# EAGLE schematic coilcube (EAGLE 6.4)
REV: 2v0; TITLE: Coilcube

## Sheet 1 of 2: EPIC & Programmer
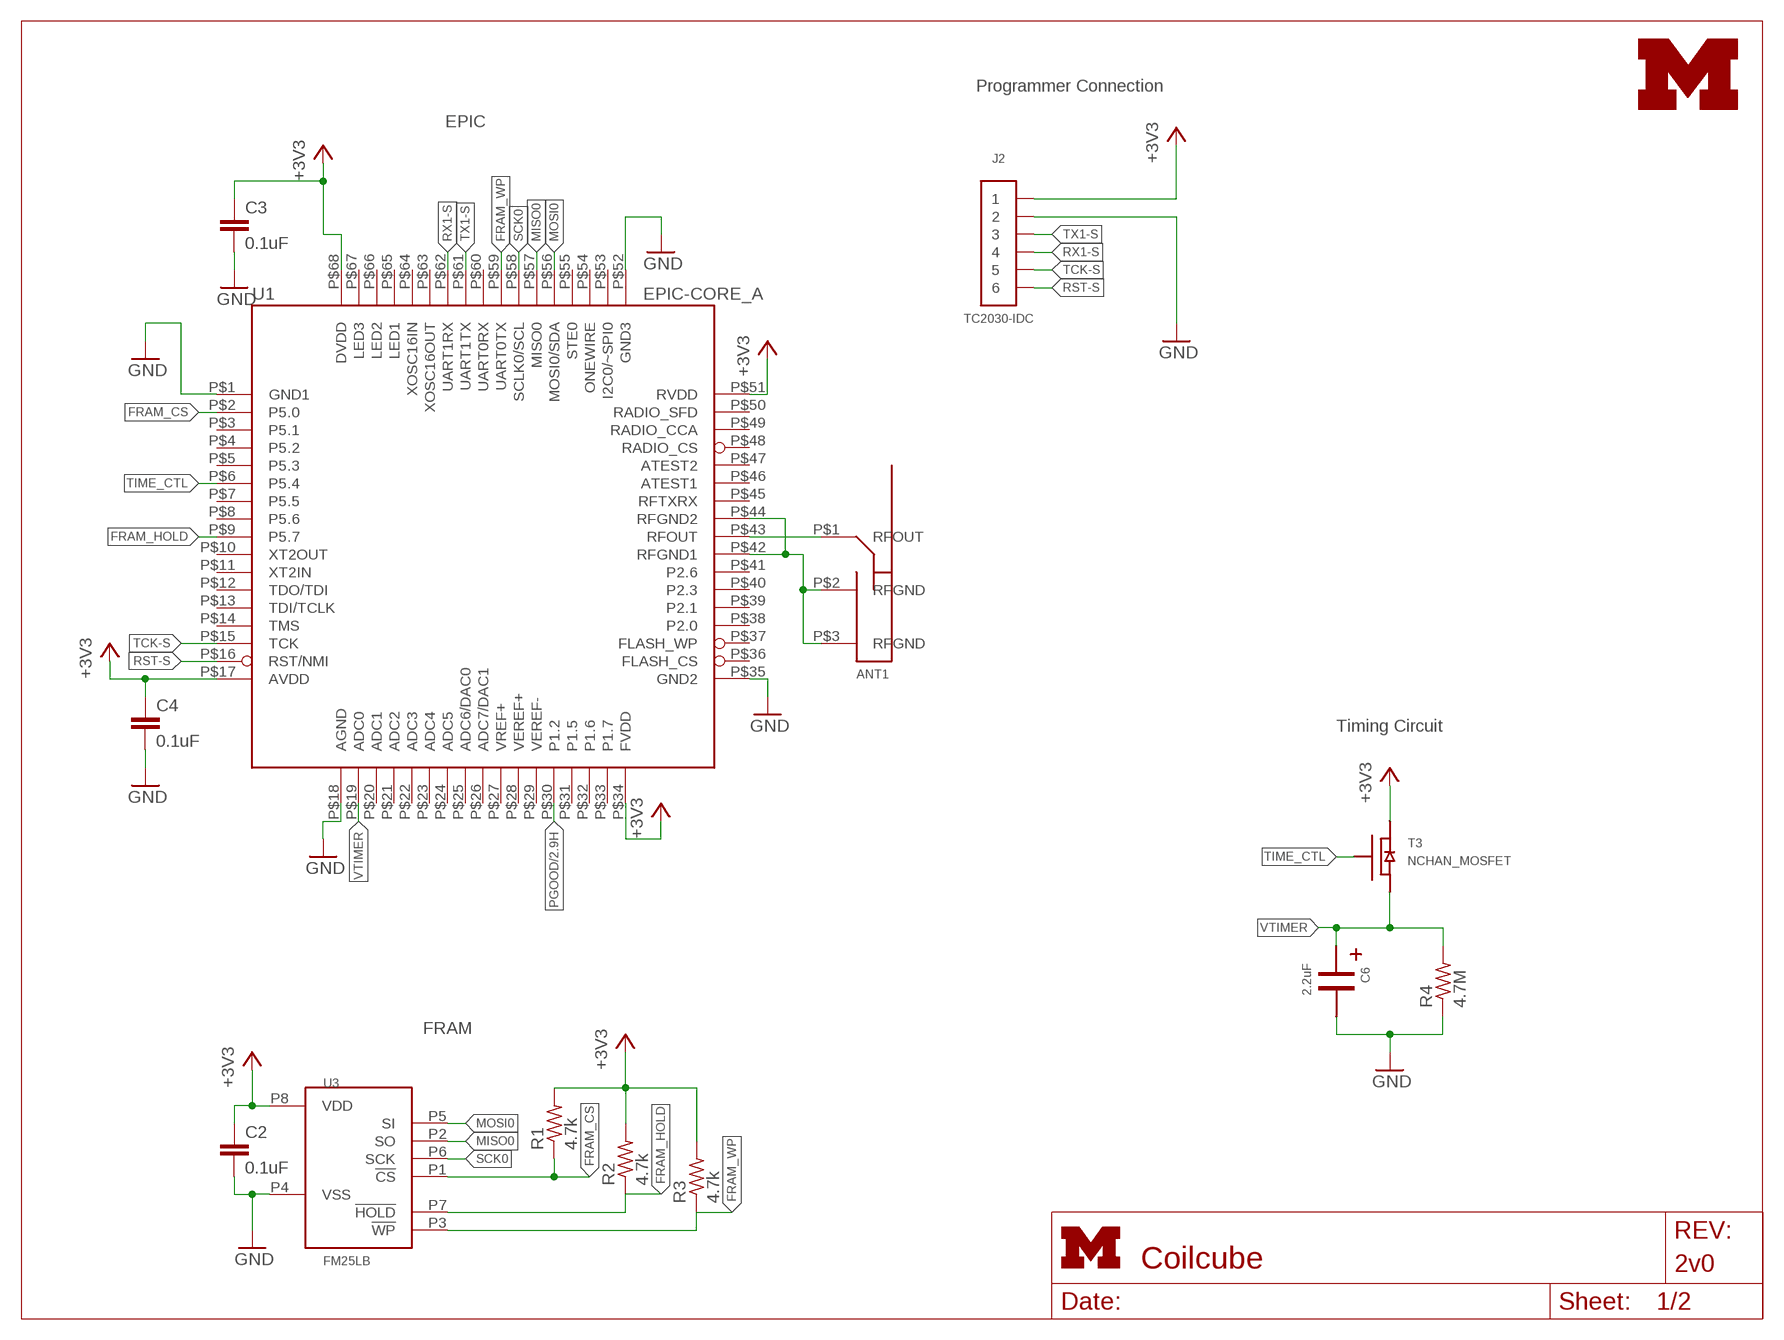
[diagram p0: schematic, sheet 1]
FRAME1 (LETTER_L): HEIGHT: 8.5in; WIDTH: 11in

### Parts
ANT1  PIFA-2.4GHZ  [PIFA-2.4GHZ]
C2  0.1uF  C-EUC0603  [C0603]
C3  0.1uF  C-EUC0603  [C0603]
C4  0.1uF  C-EUC0603  [C0603]
C6  2.2uF  CAP_POLEA1MM5  [CPOL_EEA_1MM5]
J2  TC2030-IDC  [TC2030-IDC]
R1  4.7k  R-US_R0603  [R0603]
R2  4.7k  R-US_R0603  [R0603]
R3  4.7k  R-US_R0603  [R0603]
R4  4.7M  R-US_R0805  [R0805]
T3  NCHAN_MOSFET  [NCHAN_MOSFET]
U1  EPIC-CORE_A  [EPIC-LCC68]
U3  FM25LB  [SOIC_8]
U$1  UMICH_SOLID_MEDIUM  [UMICH_SOLID_200MIL]

### Nets
+3V3: C2.1 C3.1 C4.1 J2.1 R1.2 R2.2 R3.2 T3.D U1.P$17(AVDD) U1.P$34(FVDD) U1.P$51(RVDD) U1.P$68(DVDD) U3.P8(VDD) ; also sheet 2
FRAM_CS: R1.1 U1.P$2(P5.0) U3.P1(!CS)
FRAM_HOLD: R2.1 U1.P$9(P5.7) U3.P7(!HOLD)
FRAM_WP: R3.1 U1.P$59(UART0TX) U3.P3(!WP)
GND: C2.2 C3.2 C4.2 C6.- J2.2 R4.1 U1.P$1(GND1) U1.P$18(AGND) U1.P$35(GND2) U1.P$52(GND3) U3.P4(VSS) ; also sheet 2
MISO0: U1.P$57(MISO0) U3.P2(SO)
MOSI0: U1.P$56(MOSI0/SDA) U3.P5(SI)
N$1: ANT1.P$1(RFOUT) U1.P$43(RFOUT)
PGOOD: U1.P$30(P1.2) ; also sheet 2
RFGND: ANT1.P$2(RFGND) ANT1.P$3(RFGND) U1.P$42(RFGND1) U1.P$44(RFGND2)
RST-S: J2.6 U1.P$16(RST/NMI)
RX1-S: J2.4 U1.P$62(UART1RX)
SCK0: U1.P$58(SCLK0/SCL) U3.P6(SCK)
TCK-S: J2.5 U1.P$15(TCK)
TIME_CTL: T3.G U1.P$6(P5.4)
TX1-S: J2.3 U1.P$61(UART1TX)
VTIMER: C6.+ R4.2 T3.S U1.P$19(ADC0)
Unconnected: U1.P$3(P5.1) U1.P$4(P5.2) U1.P$5(P5.3) U1.P$7(P5.5) U1.P$8(P5.6) U1.P$10(XT2OUT) U1.P$11(XT2IN) U1.P$12(TDO/TDI) U1.P$13(TDI/TCLK) U1.P$14(TMS) U1.P$20(ADC1) U1.P$21(ADC2) U1.P$22(ADC3) U1.P$23(ADC4) U1.P$24(ADC5) U1.P$25(ADC6/DAC0) U1.P$26(ADC7/DAC1) U1.P$27(VREF+) U1.P$28(VEREF+) U1.P$29(VEREF-) U1.P$31(P1.5) U1.P$32(P1.6) U1.P$33(P1.7) U1.P$36(FLASH_CS) U1.P$37(FLASH_WP) U1.P$38(P2.0) U1.P$39(P2.1) U1.P$40(P2.3) U1.P$41(P2.6) U1.P$45(RFTXRX) U1.P$46(ATEST1) U1.P$47(ATEST2) U1.P$48(RADIO_CS) U1.P$49(RADIO_CCA) U1.P$50(RADIO_SFD) U1.P$53(I2C0/~SPI0) U1.P$54(ONEWIRE) U1.P$55(STE0) U1.P$60(UART0RX) U1.P$63(XOSC16OUT) U1.P$64(XOSC16IN) U1.P$65(LED1) U1.P$66(LED2) U1.P$67(LED3)

### Notes on the sheet
- Programmer Connection
- EPIC
- Timing Circuit
- FRAM

## Sheet 2 of 2: Power Supply
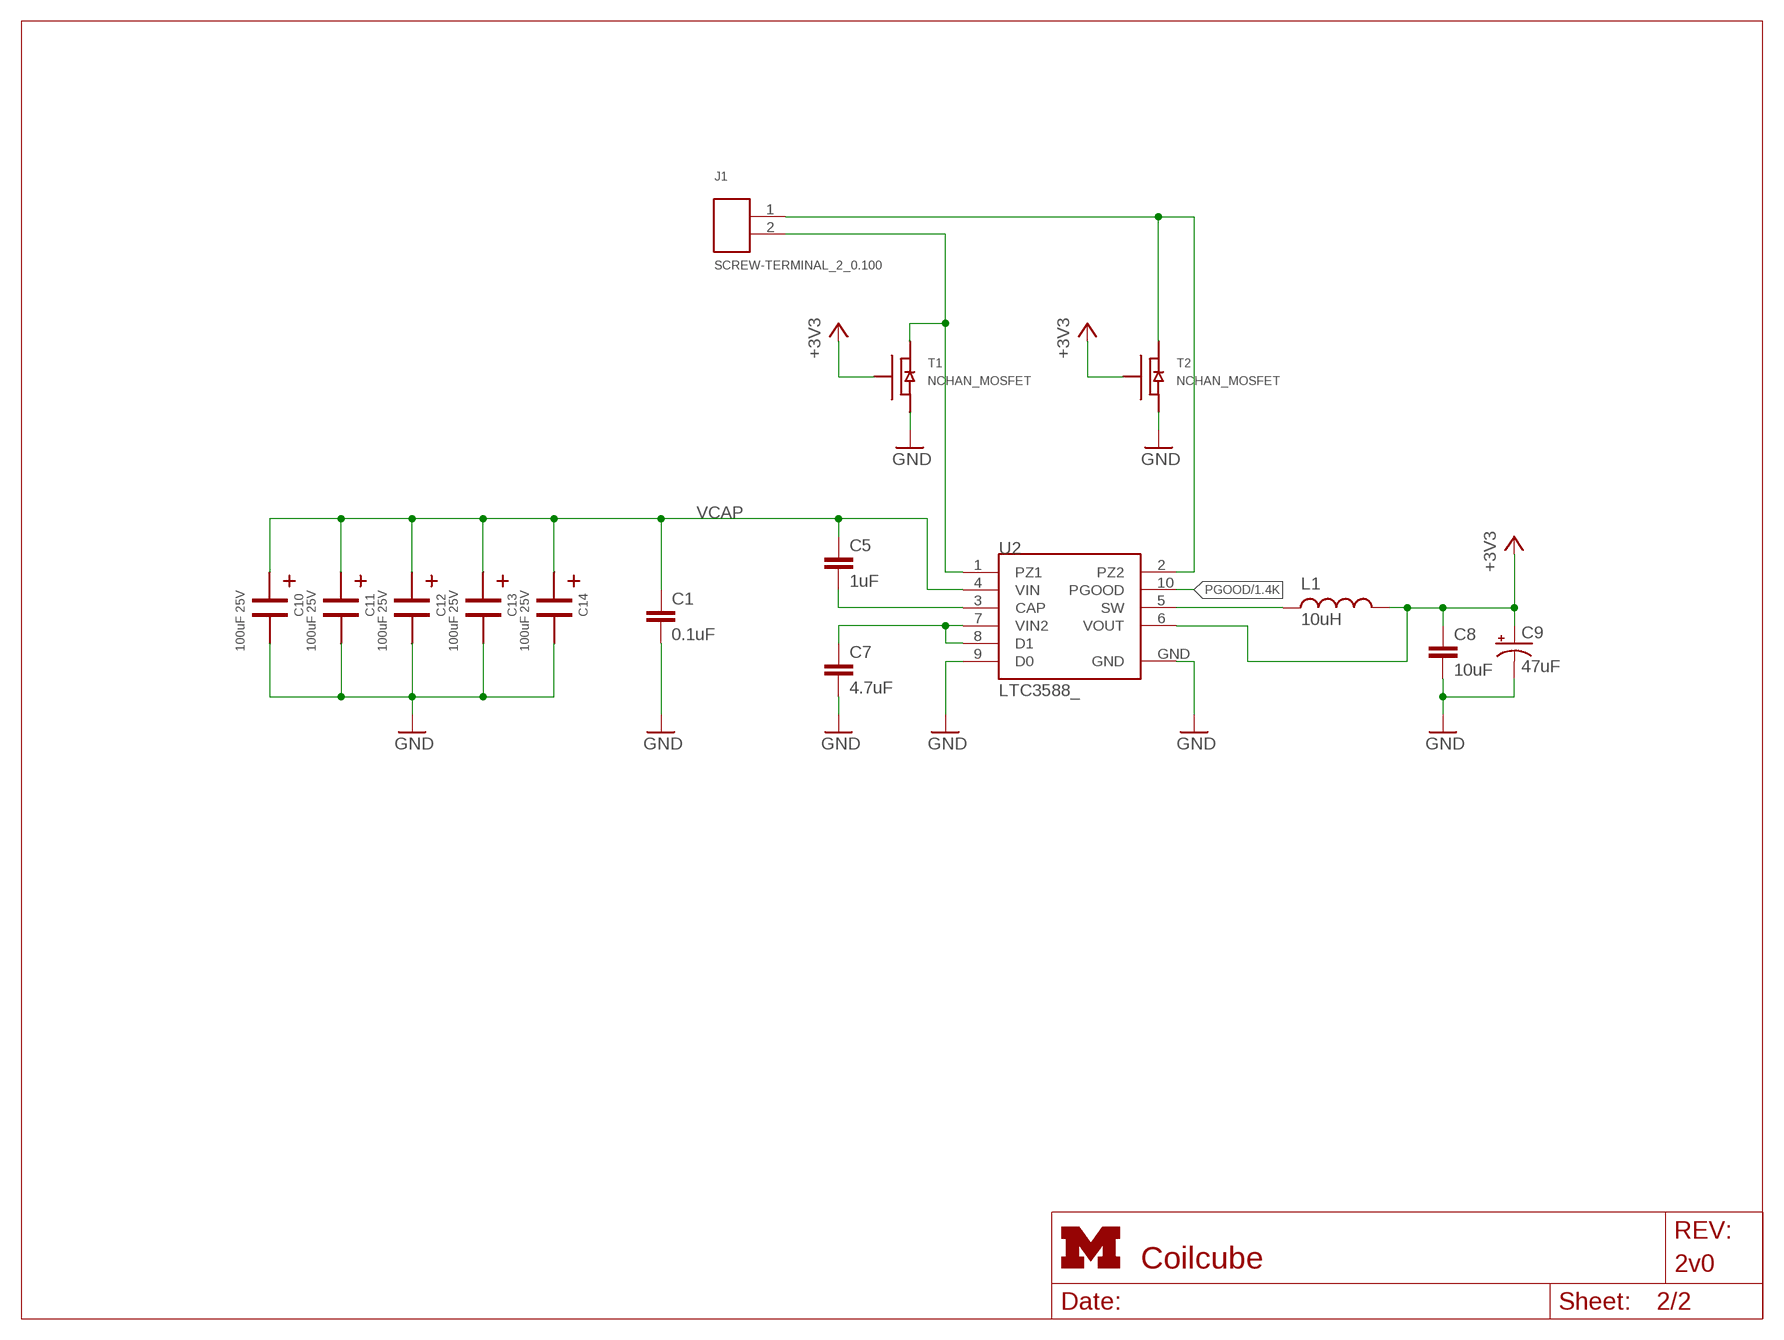
[diagram p1: schematic, sheet 2]
FRAME5 (LETTER_L): HEIGHT: 8.5in; WIDTH: 11in

### Parts
C1  0.1uF  C-EUC0603  [C0603]
C5  1uF  C-EUC0603  [C0603]
C7  4.7uF  C-EUC0603  [C0603]
C8  10uF  C-EUC1206  [C1206]
C9  47uF  CAP_POL1206  [EIA3216]
C10  100uF 25V  2917_CAP_POL  [2917_CAP_POL]
C11  100uF 25V  2917_CAP_POL  [2917_CAP_POL]
C12  100uF 25V  2917_CAP_POL  [2917_CAP_POL]
C13  100uF 25V  2917_CAP_POL  [2917_CAP_POL]
C14  100uF 25V  2917_CAP_POL  [2917_CAP_POL]
J1  SCREW-TERMINAL_2_0.100  [CONN_BLOCK_2]
L1  10uH  INDUCTOR1210  [1210]
T1  NCHAN_MOSFET  [NCHAN_MOSFET]
T2  NCHAN_MOSFET  [NCHAN_MOSFET]
U2  LTC3588_  [MSOP-10-GNDPAD]

### Nets
+3V3: C8.1 C9.A(+) L1.2 T1.G T2.G U2.6(VOUT) ; also sheet 1
GND: C1.2 C7.2 C8.2 C9.C(-) C10.- C11.- C12.- C13.- C14.- T1.S T2.S U2.9(D0) U2.GND ; also sheet 1
N$20: L1.1 U2.5(SW)
N$22: C5.2 U2.3(CAP)
PGOOD: U2.10(PGOOD) ; also sheet 1
PZ1: J1.2 T1.D U2.1(PZ1)
PZ2: J1.1 T2.D U2.2(PZ2)
VCAP: C1.1 C5.1 C10.+ C11.+ C12.+ C13.+ C14.+ U2.4(VIN)
VIN2: C7.1 U2.7(VIN2) U2.8(D1)

## Library data of the parts
ANT1 = berkeley-epic:PIFA-2.4GHZ
C1-C4 = rcl:C-EU: CAPACITOR, European symbol; DIGIKEY: 445-1316-1-ND
C5 = rcl:C-EU: CAPACITOR, European symbol; DIGIKEY: 445-1321-1-ND
C6 = coilcube:CAP_POL; DIGIKEY: P14506-ND
C7 = rcl:C-EU: CAPACITOR, European symbol; DIGIKEY: 445-5178-1-ND
C8 = rcl:C-EU: CAPACITOR, European symbol; DIGIKEY: 399-8152-1-ND
C9 = SparkFun-Passives:CAP_POL: Capacitor Polarized These are standard SMD and PTH capacitors. Normally 10uF, 47uF, and 100uF in electrolytic and tantalum varieties. Always verify the external diameter of the through hole cap, it varies with capacity, voltage, and manufacturer. The EIA devices should be standard.; DIGIKEY: 399-3700-1-ND
C10-C14 = coilcube:2917_CAP_POL; DIGIKEY: 399-5175-1-ND
J1 = headers:SCREW-TERMINAL_2_0.100: 2x 0.100 in screw terminal block; DIGIKEY: 277-1273-ND
J2 = connector:TC2030-IDC: The TC2030-IDC is our "Legged" 6-pin Plug-of-Nailstm Cable fitted with a 6-pin 0.1" pitch ribbon connector.; TAGCONNECT: TC2030-IDC
L1 = SparkFun-Passives:INDUCTOR: Inductors Basic Inductor/Choke - 0603 and 1206. Footprints are not proven and vary greatly between part numbers.; DIGIKEY: 587-1625-1-ND
R1-R3 = rcl:R-US_: RESISTOR, American symbol; DIGIKEY: P4.7KGCT-ND
R4 = rcl:R-US_: RESISTOR, American symbol; DIGIKEY: P4.7MACT-ND
T1 T2 = Power_Metering:NCHAN_MOSFET; DIGIKEY: SI1302DL-T1-GE3CT-ND
T3 = Power_Metering:NCHAN_MOSFET; DIGIKEY: 568-3244-1-ND
U1 = berkeley-epic:EPIC-CORE_A
U2 = SparkFun-PowerIC:LTC3588: Energy Harvesting Power Supply; DIGIKEY: LTC3588EMSE-1#PBF-ND
U3 = coilcube:FM25LB; DIGIKEY: 428-3210-ND
U$1 = logos:UMICH_SOLID